# Altium schematic sheet differential.SchDoc: {Наименование}
size 420 x 297 mm; DocumentNumber: НРДЦ.ХХХХХХ.ХХХ ХХ; SheetNumber: 8; SheetTotal: 8; PageSetup: Record=PageOptions|CenterHorizontal=False|CenterVertical=False|PrintScale=0.95|XCorrection=0.00|YCorrection=0.00|PrintKind=1|BorderSize=5000000|LeftOffset=0|BottomOffset=0|Orientation=1|PaperLength=1000|PaperWidth=1000|Scale=100|PaperSource=15|PrintQuality=600|MediaType=1|DitherType=10|PaperKind=A4|PrintScaleMode=1; Rule: PcbType=ProtelPcb
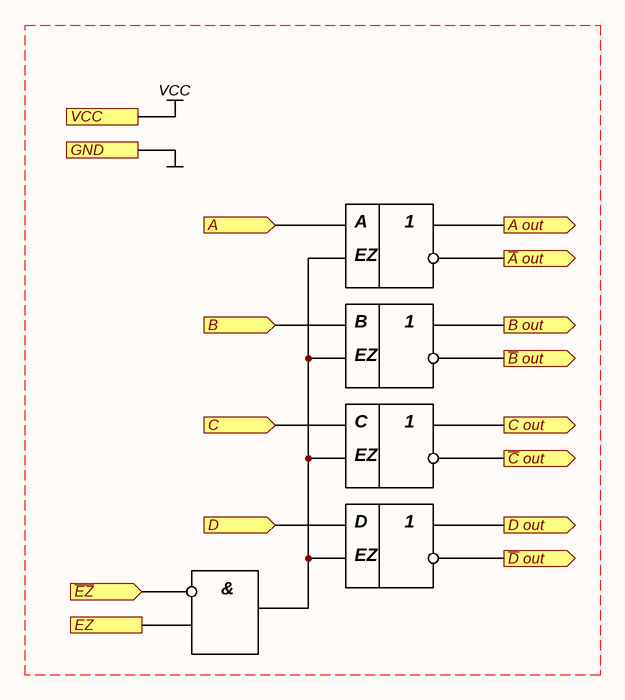
[diagram p0: differential.SchDoc]

## Ports
A (in), A out (out), B (in), B out (out), C (in), C out (out), D (in), D out (out), EZ, GND, VCC, ~{A} out (out), ~{B} out (out), ~{C} out (out), ~{D} out (out), ~{EZ} (in)

## Nets
VCC: port VCC

## Notes on the sheet
- A
- EZ
- 1
- B
- C
- D
- &
- Подп. и дата
- Инв. № дубл.
- Взам. инв. №
- Инв. № подл.
- Лист
- Изм.
- № докум.
- Подп.
- Дата
- Копировал
- Формат А3